# EAGLE design main (EAGLE 9.6.2)

## Sheet 1 of 2
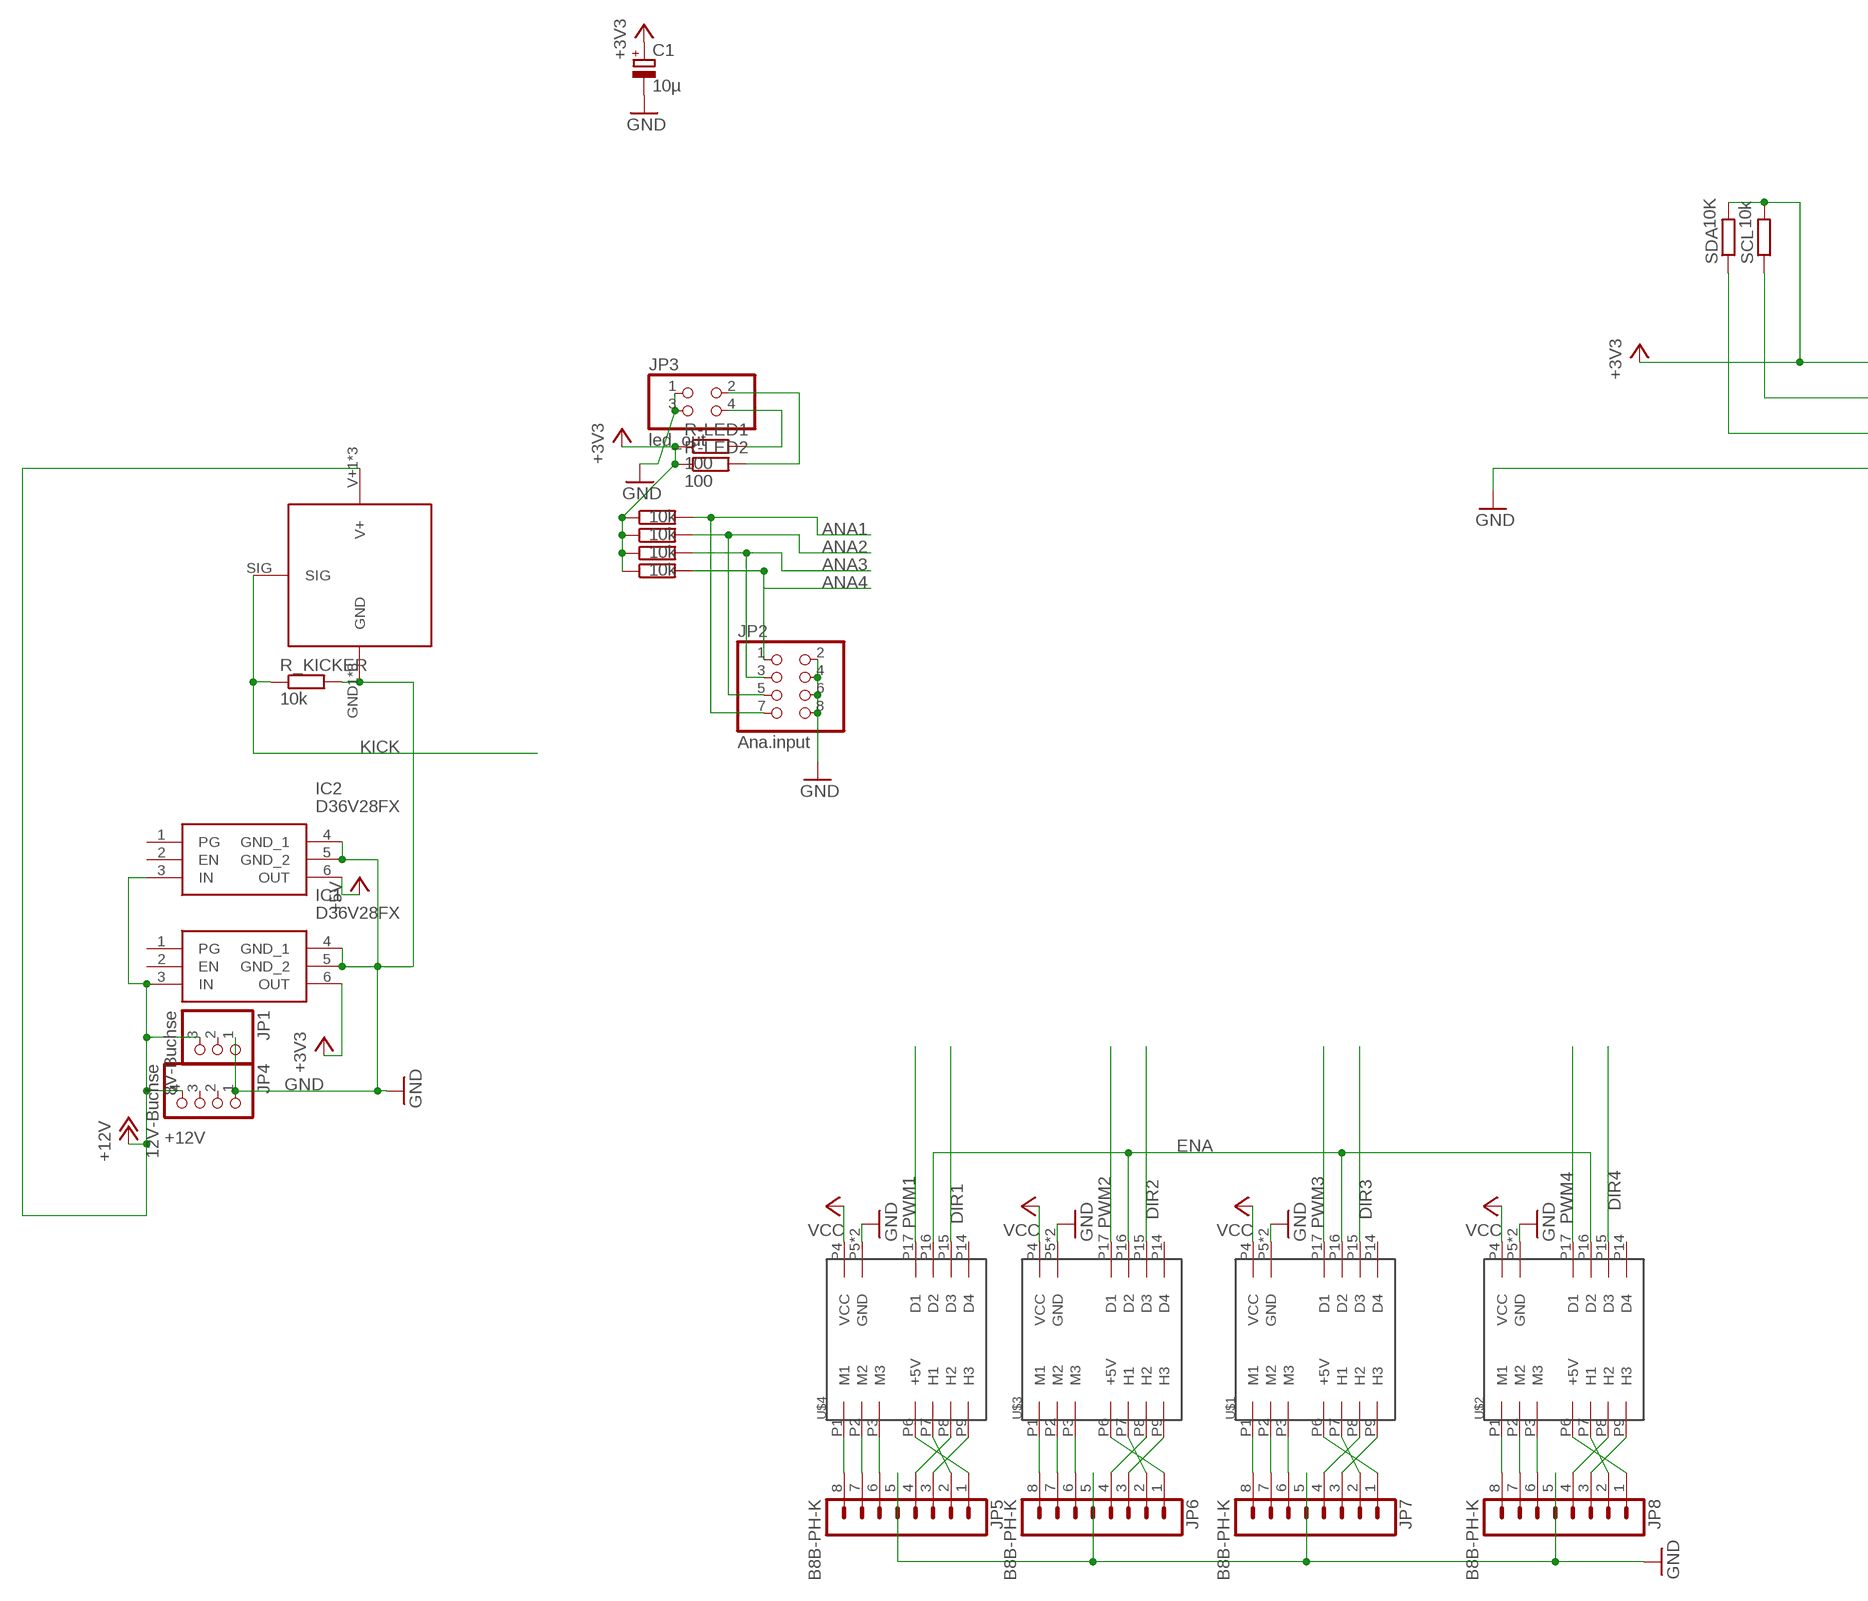
[diagram p0: schematic, sheet 1, part 1 of 2]
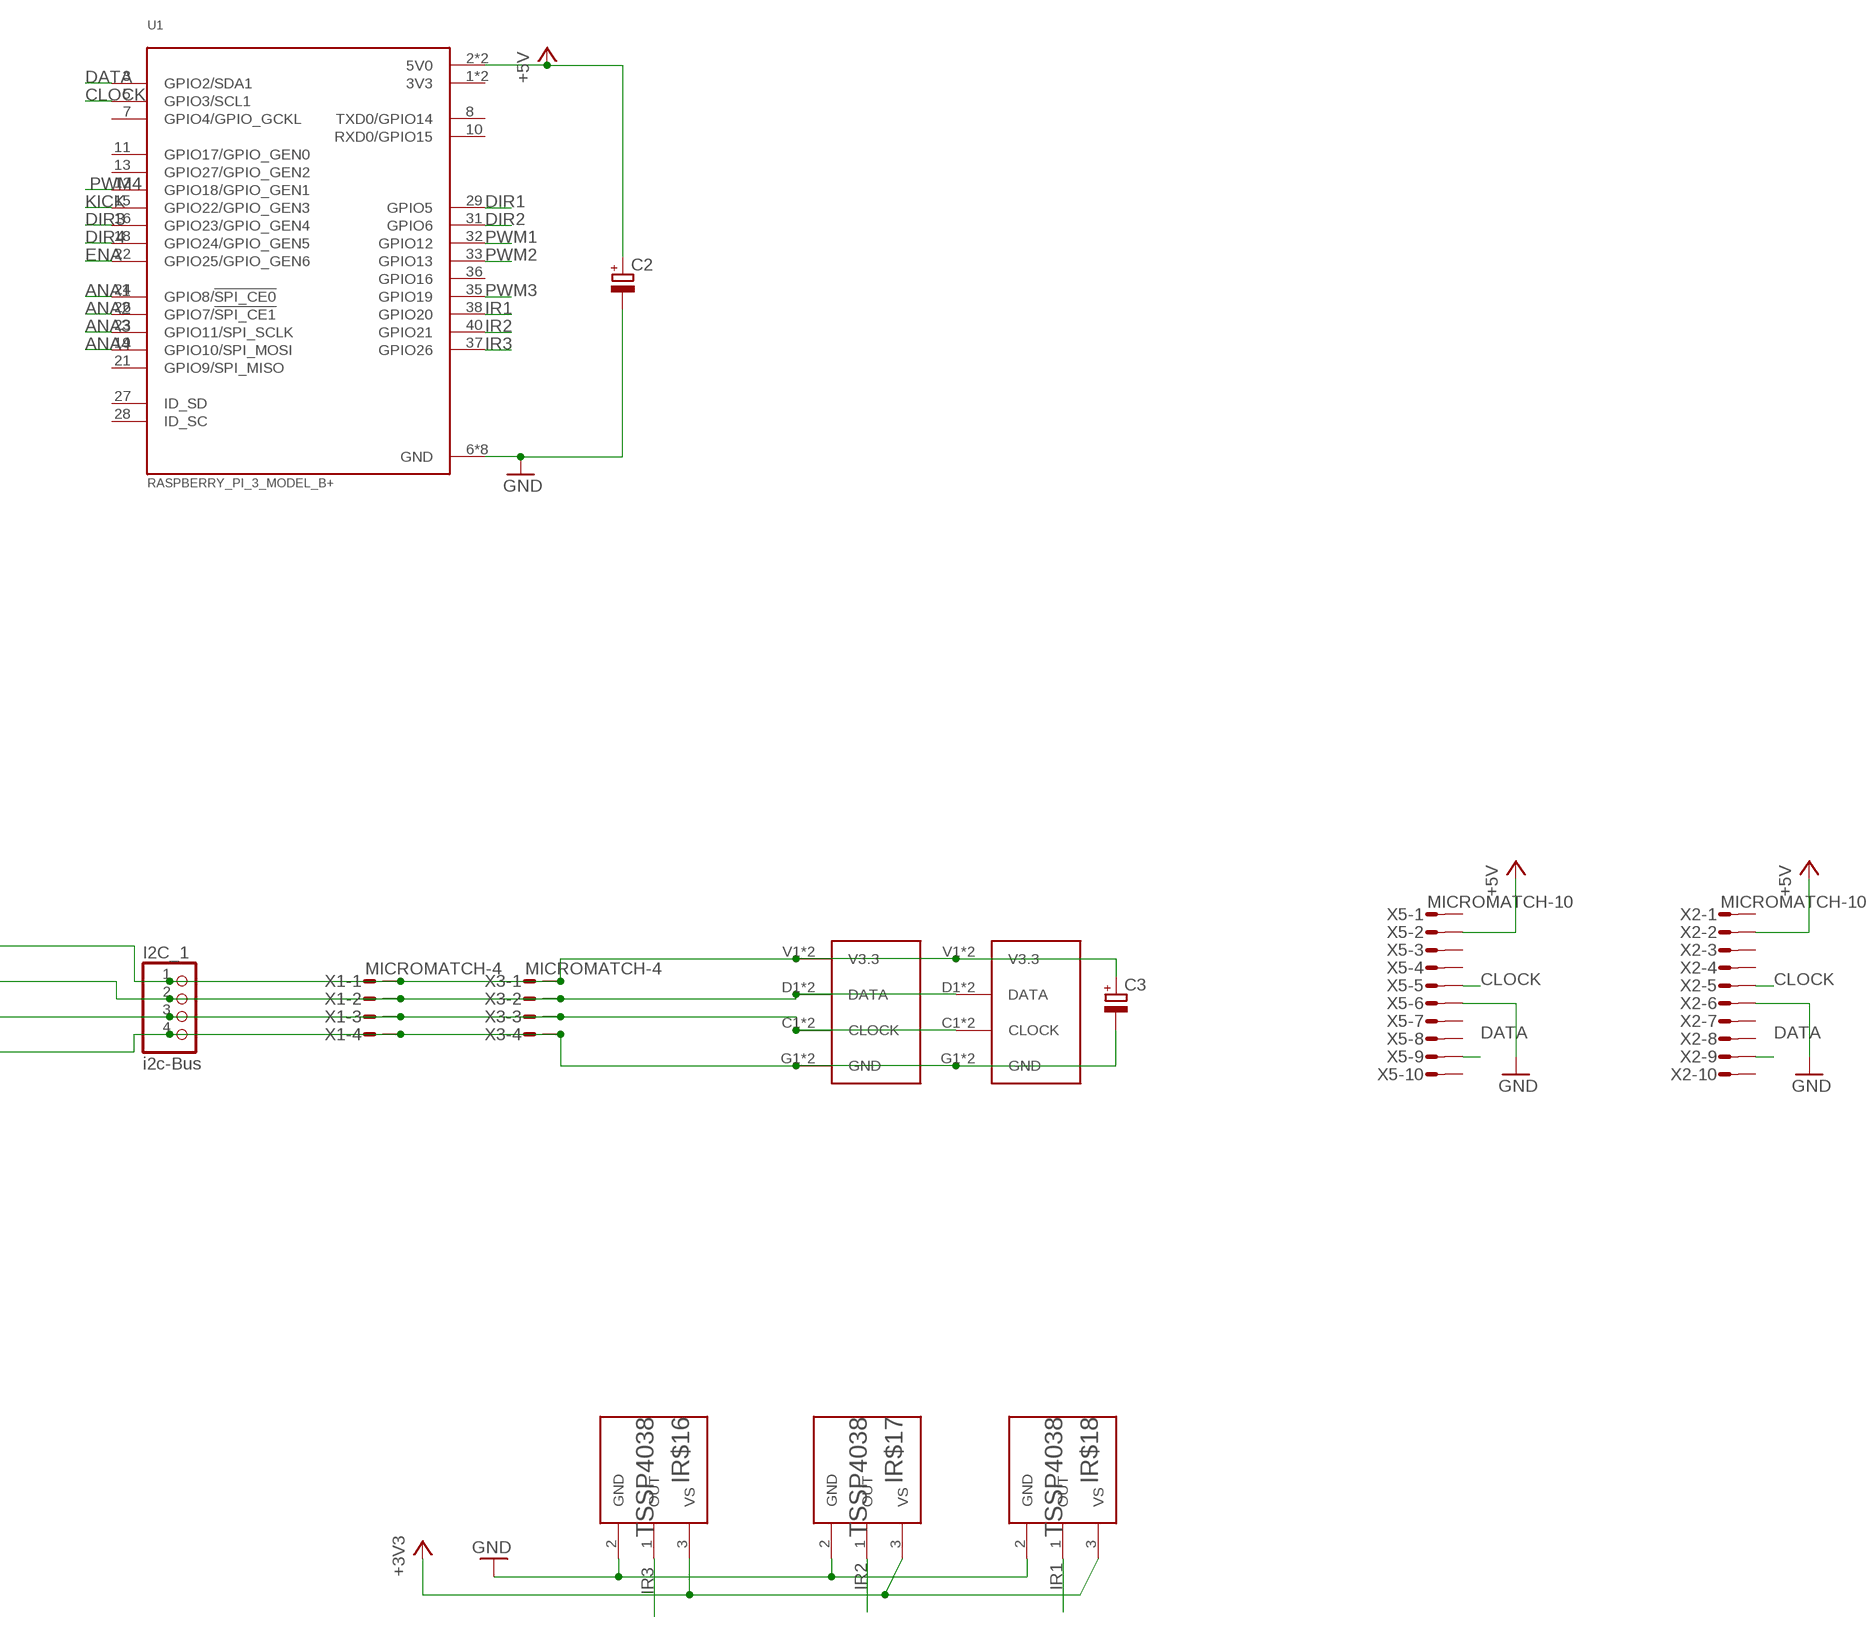
[diagram p1: schematic, sheet 1, part 2 of 2]

### Parts
C1  10µ  CPOL-EUE2,5-6E  [E2,5-6E]
C2  CPOL-EUE2-5  [E2-5]
C3  CPOL-EUE2-5  [E2-5]
I2C_1  i2c-Bus  PINHD-1X4  [1X04]
IC1  D36V28FX  [D36V28FX]
IC2  D36V28FX  [D36V28FX]
IR$16  TSSP4038  [XDCR_TSSP4038]
IR$17  TSSP4038  [XDCR_TSSP4038]
IR$18  TSSP4038  [XDCR_TSSP4038]
JP1  8V-Buchse  PINHD-1X3  [1X03]
JP2  Ana.input  PINHD-2X4  [2X04]
JP3  led_out  PINHD-2X2  [2X02]
JP4  12V-Buchse  PINHD-1X4  [1X04]
JP5  B8B-PH-K  [B8B-PH-K]
JP6  B8B-PH-K  [B8B-PH-K]
JP7  B8B-PH-K  [B8B-PH-K]
JP8  B8B-PH-K  [B8B-PH-K]
R-LED1  100  R-EU_0207/10  [0207/10]
R-LED2  100  R-EU_0207/10  [0207/10]
R_AD14  10k  R-EU_0207/10  [0207/10]
R_AD25  10k  R-EU_0207/10  [0207/10]
R_AD26  10k  R-EU_0207/10  [0207/10]
R_AD27  10k  R-EU_0207/10  [0207/10]
R_KICKER  10k  R-EU_0207/10  [0207/10]
SCL  10k  R-EU_0207/10  [0207/10]
SDA  10K  R-EU_0207/10  [0207/10]
U1  RASPBERRY_PI_3_MODEL_B+  [MODULE_RASPBERRY_PI_3_MODEL_B+]
U$1  24/2  [24/2]
U$2  24/2  [24/2]
U$3  24/2  [24/2]
U$4  24/2  [24/2]
U$8  TASTER_LED  [TASTER_LED]
U$9  TASTER_LED  [TASTER_LED]
U$17  KICKER  [KICKER]
X1  MICROMATCH-4  [MICROMATCH-4]
X2  MICROMATCH-10  [MICROMATCH-10]
X3  MICROMATCH-4  [MICROMATCH-4]
X5  MICROMATCH-10  [MICROMATCH-10]

### Nets
+3V3: C1.+ C3.+ I2C_1.1 IC1.6(OUT) IR$16.3(VS) IR$17.3(VS) IR$18.3(VS) R-LED1.1 R-LED2.1 R_AD14.1 R_AD25.1 R_AD26.1 R_AD27.1 SCL.2 SDA.2 U$8.V1(V3.3) U$8.V2(V3.3) U$9.V1(V3.3) U$9.V2(V3.3) X1.1 X3.1
+5V: C2.+ IC2.6(OUT) U1.2(5V0) U1.4(5V0) X2.2 X5.2
+12V: IC1.3(IN) IC2.3(IN) JP1.3 JP4.4 U$17.V+1(V+) U$17.V+2(V+) U$17.V+3(V+)
ANA1: JP2.7 R_AD25.2 U1.24(GPIO8/!SPI_CE0!)
ANA2: JP2.5 R_AD26.2 U1.26(GPIO7/!SPI_CE1!)
ANA3: JP2.3 R_AD27.2 U1.23(GPIO11/SPI_SCLK)
ANA4: JP2.1 R_AD14.2 U1.19(GPIO10/SPI_MOSI)
CLOCK: I2C_1.3 SDA.1 U1.5(GPIO3/SCL1) U$8.C1(CLOCK) U$8.C2(CLOCK) U$9.C1(CLOCK) U$9.C2(CLOCK) X1.3 X2.5 X3.3 X5.5
DATA: I2C_1.2 SCL.1 U1.3(GPIO2/SDA1) U$8.D1(DATA) U$8.D2(DATA) U$9.D1(DATA) U$9.D2(DATA) X1.2 X2.9 X3.2 X5.9
DIR1: U1.29(GPIO5) U$4.P15(D3)
DIR2: U1.31(GPIO6) U$3.P15(D3)
DIR3: U1.16(GPIO23/GPIO_GEN4) U$1.P15(D3)
DIR4: U1.18(GPIO24/GPIO_GEN5) U$2.P15(D3)
ENA: U1.22(GPIO25/GPIO_GEN6) U$1.P16(D2) U$2.P16(D2) U$3.P16(D2) U$4.P16(D2)
GND: C1.- C2.- C3.- I2C_1.4 IC1.4(GND_1) IC1.5(GND_2) IC2.4(GND_1) IC2.5(GND_2) IR$16.2(GND) IR$17.2(GND) IR$18.2(GND) JP1.1 JP2.2 JP2.4 JP2.6 JP2.8 JP3.1 JP3.3 JP4.1 JP5.5 JP6.5 JP7.5 JP8.5 R_KICKER.2 U1.6(GND) U1.9(GND) U1.14(GND) U1.20(GND) U1.25(GND) U1.30(GND) U1.34(GND) U1.39(GND) U$1.P5(GND) U$1.P18(GND) U$2.P5(GND) U$2.P18(GND) U$3.P5(GND) U$3.P18(GND) U$4.P5(GND) U$4.P18(GND) U$8.G1(GND) U$8.G2(GND) U$9.G1(GND) U$9.G2(GND) U$17.GND1(GND) U$17.GND2(GND) U$17.GND3(GND) U$17.GND4(GND) U$17.GND5(GND) U$17.GND6(GND) U$17.GND7(GND) U$17.GND8(GND) X1.4 X2.6 X3.4 X5.6
IR1: IR$18.1(OUT) U1.38(GPIO20)
IR2: IR$17.1(OUT) U1.40(GPIO21)
IR3: IR$16.1(OUT) U1.37(GPIO26)
KICK: R_KICKER.1 U1.15(GPIO22/GPIO_GEN3) U$17.SIG
N$6: JP5.8 U$4.P1(M1)
N$7: JP5.7 U$4.P2(M2)
N$8: JP3.4 R-LED1.2
N$9: JP3.2 R-LED2.2
N$10: JP5.6 U$4.P3(M3)
N$11: JP6.8 U$3.P1(M1)
N$12: JP6.7 U$3.P2(M2)
N$13: JP6.6 U$3.P3(M3)
N$14: JP7.8 U$1.P1(M1)
N$15: JP7.7 U$1.P2(M2)
N$16: JP7.6 U$1.P3(M3)
N$17: JP8.8 U$2.P1(M1)
N$18: JP8.7 U$2.P2(M2)
N$19: JP8.6 U$2.P3(M3)
N$20: JP5.1 U$4.P6(+5V)
N$21: JP6.1 U$3.P6(+5V)
N$22: JP7.1 U$1.P6(+5V)
N$23: JP8.1 U$2.P6(+5V)
N$24: JP5.2 U$4.P7(H1)
N$25: JP5.3 U$4.P9(H3)
N$26: JP5.4 U$4.P8(H2)
N$27: JP6.2 U$3.P7(H1)
N$28: JP6.3 U$3.P9(H3)
N$29: JP6.4 U$3.P8(H2)
N$30: JP7.2 U$1.P7(H1)
N$31: JP7.3 U$1.P9(H3)
N$32: JP7.4 U$1.P8(H2)
N$33: JP8.2 U$2.P7(H1)
N$34: JP8.3 U$2.P9(H3)
N$35: JP8.4 U$2.P8(H2)
PWM1: U1.32(GPIO12) U$4.P17(D1)
PWM2: U1.33(GPIO13) U$3.P17(D1)
PWM3: U1.35(GPIO19) U$1.P17(D1)
PWM4: U1.12(GPIO18/GPIO_GEN1) U$2.P17(D1)
V+: U$1.P4(VCC) U$2.P4(VCC) U$3.P4(VCC) U$4.P4(VCC) ; supply symbol labelled VCC
Unconnected: IC1.1(PG) IC1.2(EN) IC2.1(PG) IC2.2(EN) JP1.2 JP4.2 JP4.3 U1.7(GPIO4/GPIO_GCKL) U1.8(TXD0/GPIO14) U1.10(RXD0/GPIO15) U1.11(GPIO17/GPIO_GEN0) U1.13(GPIO27/GPIO_GEN2) U1.21(GPIO9/SPI_MISO) U1.27(ID_SD) U1.28(ID_SC) U1.36(GPIO16) U$1.P14(D4) U$2.P14(D4) U$3.P14(D4) U$4.P14(D4) X2.1 X2.3 X2.4 X2.7 X2.8 X2.10 X5.1 X5.3 X5.4 X5.7 X5.8 X5.10

## Sheet 2 of 2

## Power pins joined to a net without a drawn wire
3V3: U1.1(3V3) U1.17(3V3)

## Library data of the parts
C1-C3 = rcl:CPOL-EU: POLARIZED CAPACITOR, European symbol; SPICEPREFIX: C
I2C_1 JP4 = pinhead:PINHD-1X4: PIN HEADER
IC1 IC2 = D36V28FX:D36V28FX: 5V, 3.2A Step-Down Voltage Regulator D36V28F5 Source: Datasheet <https://www.pololu.com/product/3782>; DESCRIPTION: 5V, 3.2A Step-Down Voltage Regulator D36V28F5; HEIGHT: 8.77mm; MANUFACTURER_NAME: POLOLU ROBOTICS & ELECTRONICS; MANUFACTURER_PART_NUMBER: D36V28FX
IR$16-IR$18 = TSSP4038:TSSP4038: Check availability <https://pricing.snapeda.com/parts/TSSP4038/Vishay%20Semiconductor/view-part?ref=eda>; AVAILABILITY: In Stock; DESCRIPTION: Remote Receiver Sensor, 38.0kHz 1m PCB, Through Hole; MF: Vishay Semiconductor; MP: TSSP4038; PACKAGE: None; PRICE: None; PURCHASE-URL: https://pricing.snapeda.com/search/part/TSSP4038/?ref=eda
JP1 = pinhead:PINHD-1X3: PIN HEADER
JP2 = pinhead:PINHD-2X4: PIN HEADER
JP3 = pinhead:PINHD-2X2: PIN HEADER
JP5-JP8 = con-jst-ph:B8B-PH-K: HEADER
R-LED1 R-LED2 R_AD14 R_AD25-R_AD27 R_KICKER SCL SDA = rcl:R-EU_: RESISTOR, European symbol; SPICEPREFIX: R
U1 = RASPBERRY_PI_3_MODEL_B_:RASPBERRY_PI_3_MODEL_B+: BCM2835 Raspberry Pi Model B+ - ARM11, VideoCore MPU Embedded Evaluation Board Check availability <https://pricing.snapeda.com/parts/RASPBERRY%20PI%203%20MODEL%20B%2B/Raspberry%20Pi/view-part?ref=eda>; AVAILABILITY: In Stock; DESCRIPTION: RASPBERRY PI 3 MOD B+ BCM2837B0; MF: Raspberry Pi; MP: RASPBERRY PI 3 MODEL B+; PACKAGE: None; PRICE: None; PURCHASE-URL: https://pricing.snapeda.com/search/part/RASPBERRY PI 3 MODEL B+/?ref=eda
U$1-U$4 = maxon-Regler:24/2
U$8 U$9 = Taster_LED:TASTER_LED: Taster / LED Board mit 2 Tastern und 2 LEDs Angeschlossen über i2c Port Expander PCF8574TS i2c Adresse zwingend per Lötbrücke zu setzen.
U$17 = kicker:KICKER
X1 X3 = con-amp-micromatch:MICROMATCH-4: MicroMaTch 4 7-215464-4 / 0-215464-4 Drawing Number C-215464 DDEController.pdf; MPN: 7-215464-4; OC_FARNELL: 3784629; OC_NEWARK: 19R8124
X2 X5 = con-amp-micromatch:MICROMATCH-10: MicroMaTch 10 8-215464-0 / 1-215464-0 Drawing Number C-215464 DDEController.pdf; MF: FARNELL; MPN: 8-215464-0; OC_FARNELL: 3784654; OC_NEWARK: 19J6430

## Board
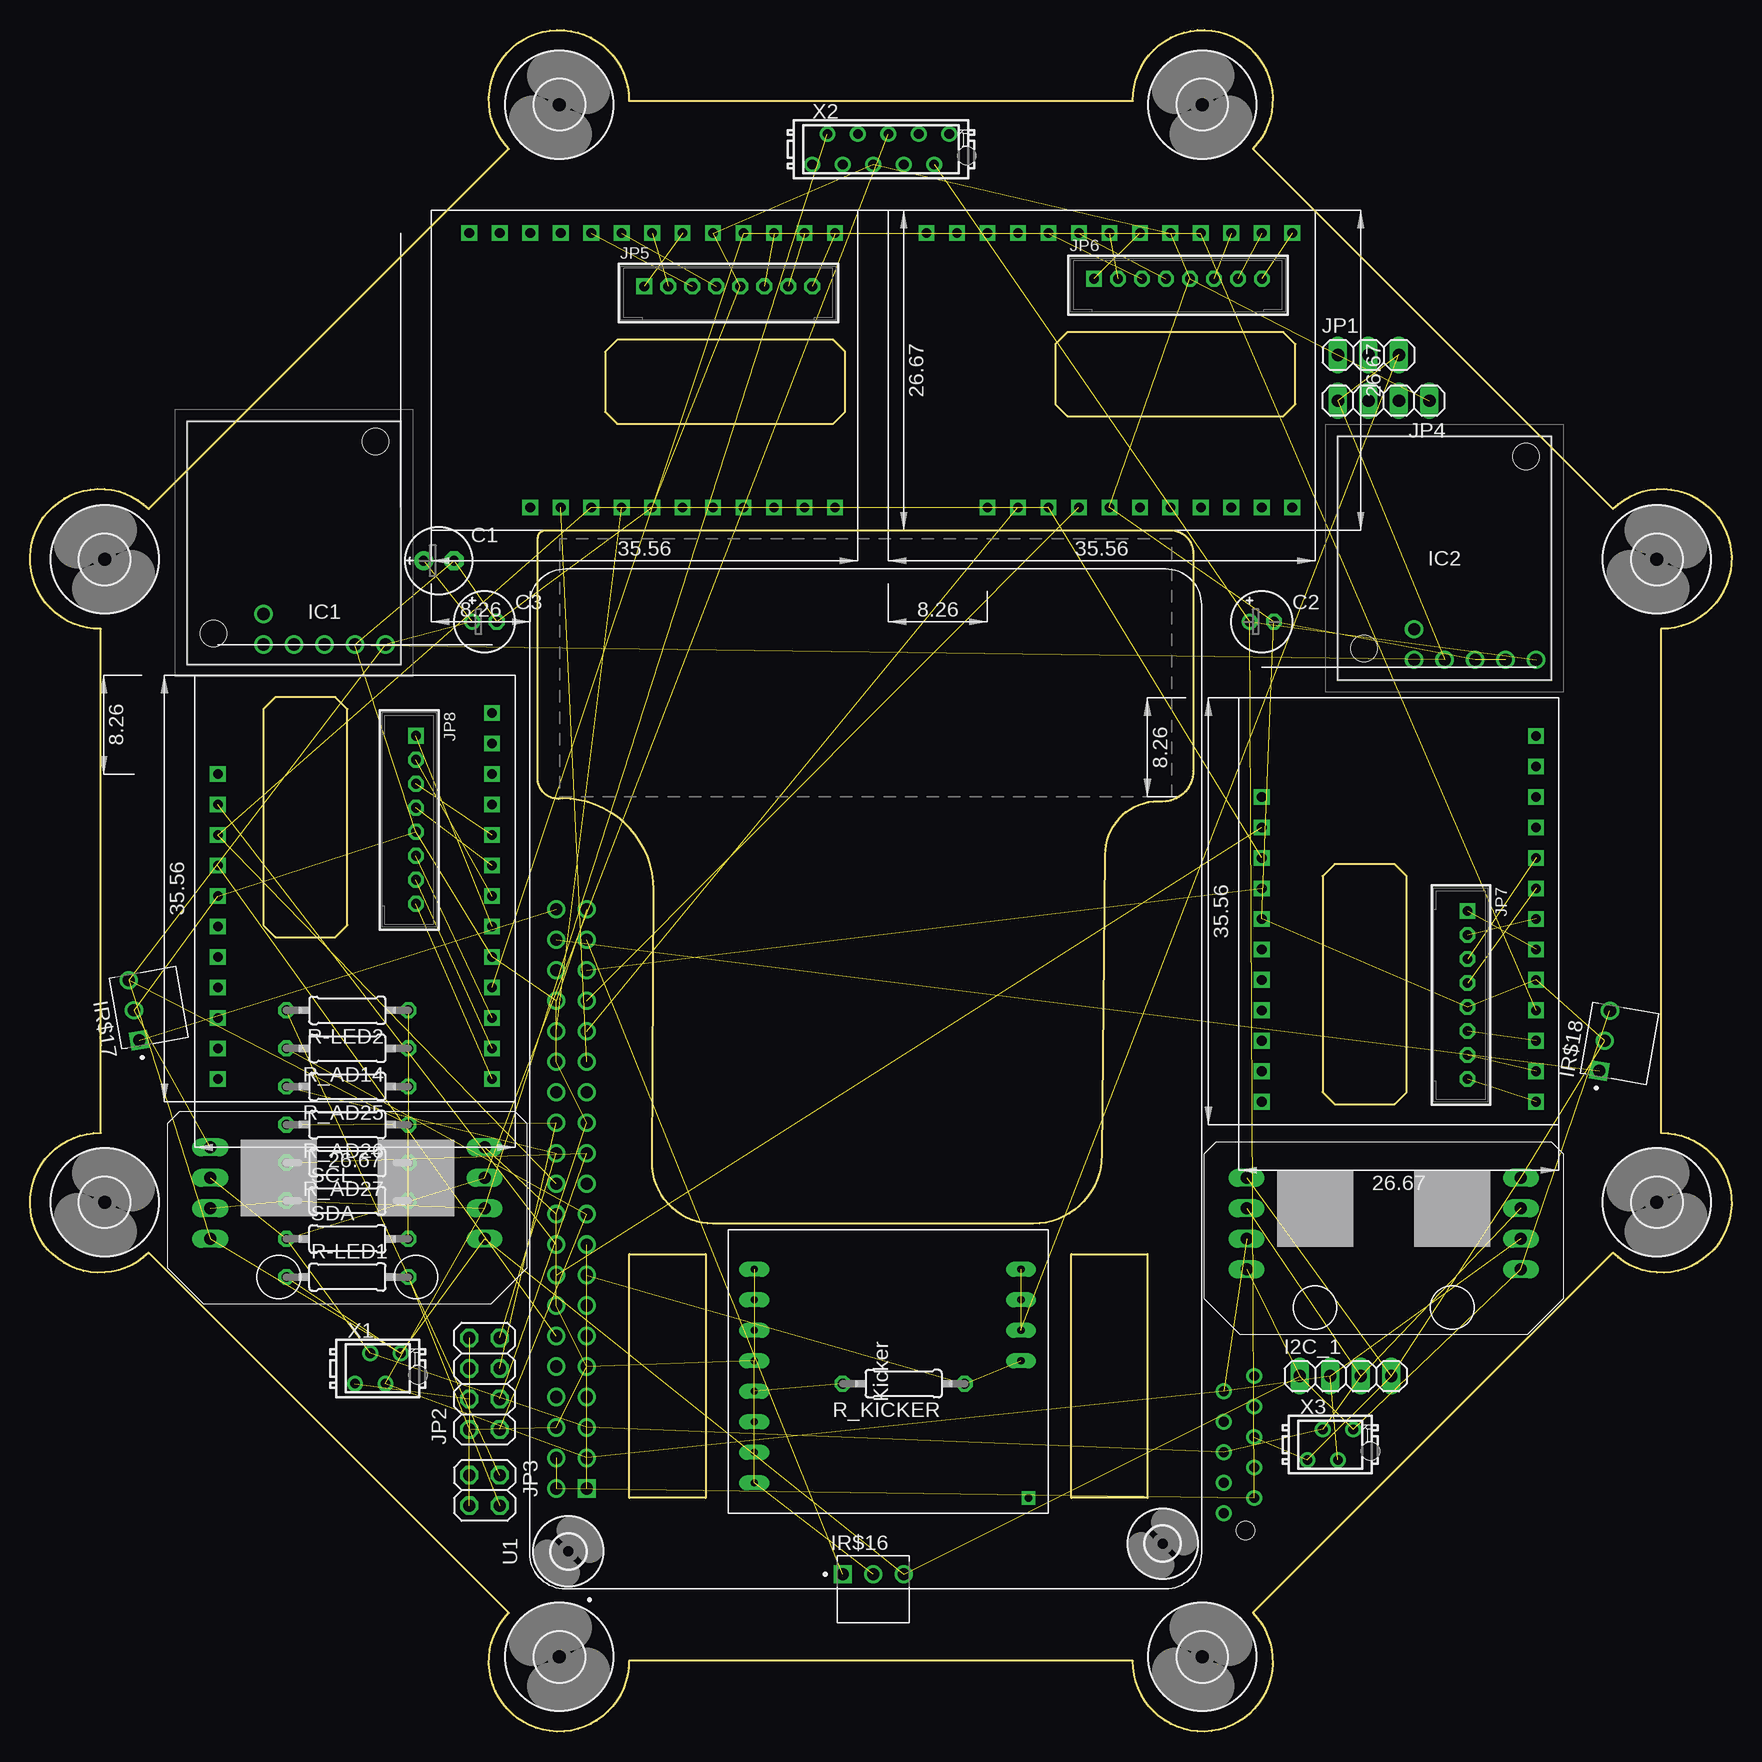
[diagram p2: board, top side]
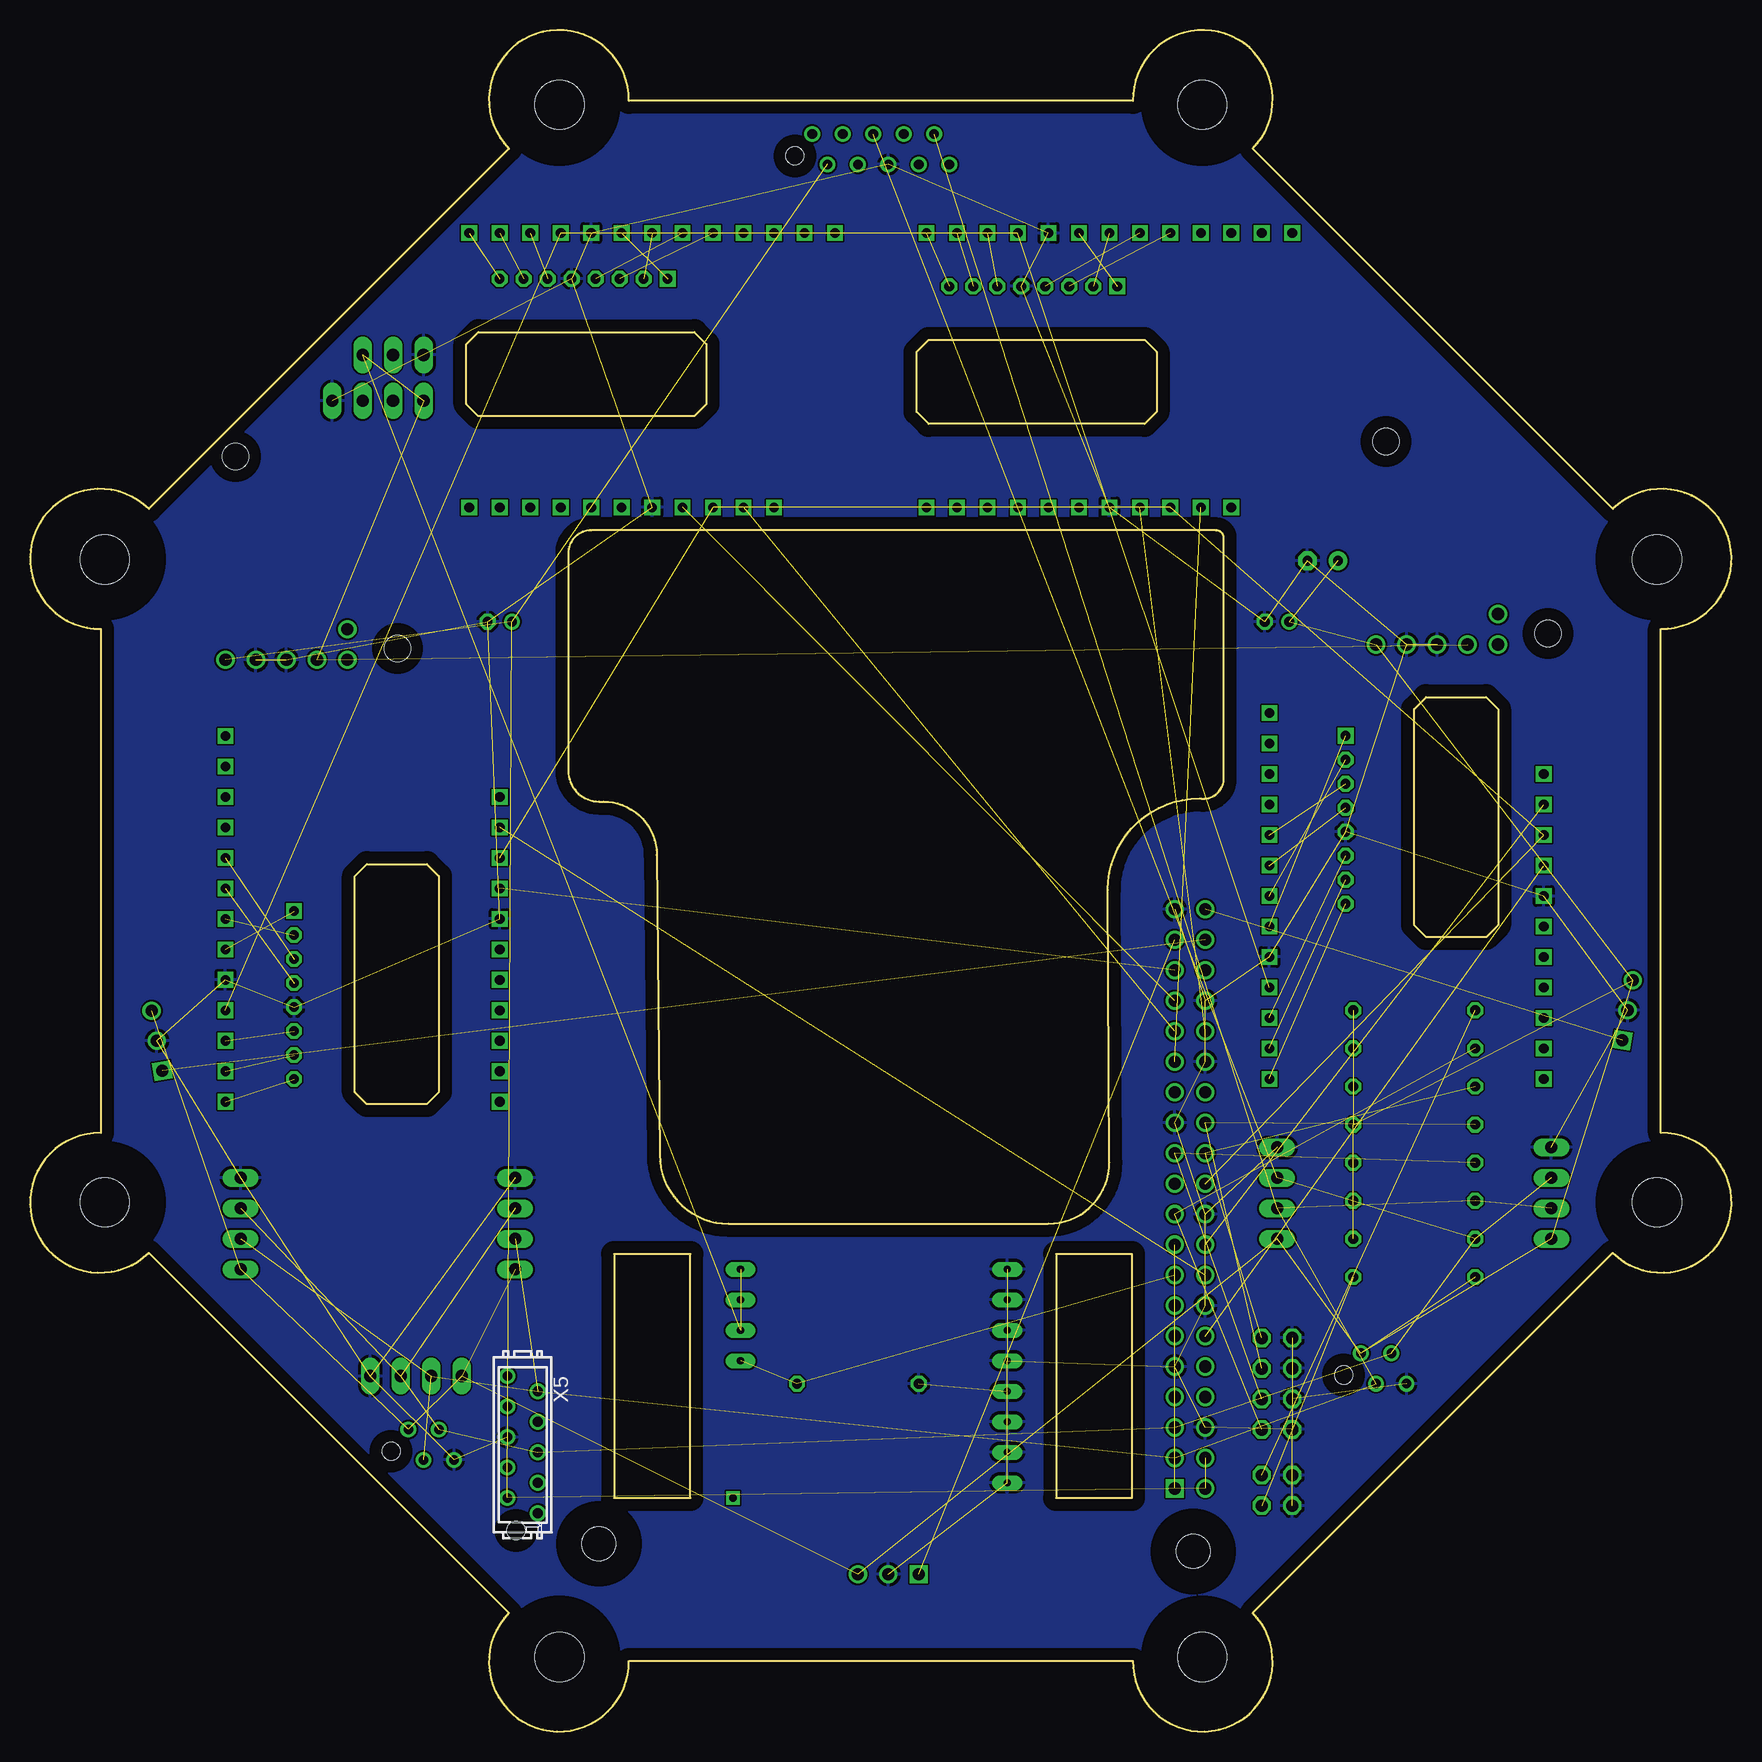
[diagram p3: board, bottom side, seen from below]

Size 141.8 x 141.8 mm. Coordinates in mm from the lower left corner, seen from the top.
Outline: 5.9,49.9 5.9,91.9 arc-225 9.9,101.9 39.9,131.9 arc-225 49.9,135.9 91.9,135.9 arc-225 101.9,131.9 131.9,101.9 arc-225 135.9,91.9 135.9,49.9 arc-225 131.9,39.9 101.9,9.9 arc-225 91.9,5.9 49.9,5.9 arc-225 39.9,9.9 9.9,39.9 arc-225 5.9,49.9
Outline: 114.71,53.29 114.71,71.29 113.71,72.29 108.71,72.29 107.71,71.29 107.71,53.29 108.71,52.29 113.71,52.29 114.71,53.29
Outline: 86.44,109.62 104.44,109.62 105.44,110.62 105.44,115.62 104.44,116.62 86.44,116.62 85.44,115.62 85.44,110.62 86.44,109.62
Outline: 26.45,67.2 26.45,85.2 25.45,86.2 20.45,86.2 19.45,85.2 19.45,67.2 20.45,66.2 25.45,66.2 26.45,67.2
Outline: 48.92,108.98 66.92,108.98 67.92,109.98 67.92,114.98 66.92,115.98 48.92,115.98 47.92,114.98 47.92,109.98 48.92,108.98
Outline: 42.96,100.11 95.03,100.11 arc-90 96.93,98.2 96.93,80.04 arc-90 94.39,77.5 94.01,77.5 arc90 89.57,73.06 89.31,48.04 arc-90 83.6,42.32 56.93,42.32 arc-90 51.85,47.4 51.97,70.14 arc90 44.35,77.76 arc-90 42.32,79.15 42.32,99.47 arc-90 42.96,100.11
Outline: 49.94,39.78 56.29,39.78 56.29,19.46 49.94,19.46 49.94,39.78
Outline: 86.77,39.78 93.12,39.78 93.12,19.46 86.77,19.46 86.77,39.78
Copper layers (1*16): Top 0.035mm / dielectric 1.5mm / Bottom 0.035mm
Design rules "default": minimum track width 6mil, minimum drill 0.35mm, track to track 6mil, track to pad 6mil, pad to pad 6mil, via to via 6mil, smd to smd 6mil, copper to edge 40mil, drill to drill 6mil, minimum pad ring 10mil, minimum via ring 8mil, stop-mask expansion 4mil, vias tented up to drill 0mil, thermal gap 10mil

### Footprints (pad centres in the part's own frame; a part is rotated, then mirrored left to right if it is on the bottom)
E2,5-6E = drill 0.813 pad 1.575: + -1.27,0 | drill 0.813 pad 1.575 octagon: - 1.27,0
E2-5 = drill 0.813 pad 1.27: + -1.016,0 | drill 0.813 pad 1.27 octagon: - 1.016,0
1X04 = drill 1.016 long: 1 -3.81,0; 2 -1.27,0; 3 1.27,0; 4 3.81,0
D36V28FX = drill 1.02 pad 1.53: 1 0,0; 2 0,-2.54; 3 2.54,-2.54; 4 5.08,-2.54; 5 7.62,-2.54; 6 10.16,-2.54 | hole 2.18: -4.17,-1.61; 9.33,14.39
XDCR_TSSP4038 = drill 1.01 square: 1 -2.54,0 | drill 1.01: 2 0,0; 3 2.54,0
1X03 = drill 1.016 long: 1 -2.54,0; 2 0,0; 3 2.54,0
2X04 = drill 1.016 octagon: 1 -3.81,-1.27; 2 -3.81,1.27; 3 -1.27,-1.27; 4 -1.27,1.27; 5 1.27,-1.27; 6 1.27,1.27; 7 3.81,-1.27; 8 3.81,1.27
2X02 = drill 1.016 octagon: 1 -1.27,-1.27; 2 -1.27,1.27; 3 1.27,-1.27; 4 1.27,1.27
B8B-PH-K = drill 0.813 square: 1 -7,0 | drill 0.813 octagon: 2 -5,0; 3 -3,0; 4 -1,0; 5 1,0; 6 3,0; 7 5,0; 8 7,0
0207/10 = drill 0.813 octagon: 1 -5.08,0; 2 5.08,0
MODULE_RASPBERRY_PI_3_MODEL_B+ = drill 1.016 square: 1 -34.13,23.23 | drill 1.016: 2 -34.13,25.77; 3 -31.59,23.23; 4 -31.59,25.77; 5 -29.05,23.23; 6 -29.05,25.77; 7 -26.51,23.23; 8 -26.51,25.77; 9 -23.97,23.23; 10 -23.97,25.77; 11 -21.43,23.23; 12 -21.43,25.77; 13 -18.89,23.23; 14 -18.89,25.77; 15 -16.35,23.23; 16 -16.35,25.77; 17 -13.81,23.23; 18 -13.81,25.77; 19 -11.27,23.23; 20 -11.27,25.77; 21 -8.73,23.23; 22 -8.73,25.77; 23 -6.19,23.23; 24 -6.19,25.77; 25 -3.65,23.23; 26 -3.65,25.77; 27 -1.11,23.23; 28 -1.11,25.77; 29 1.43,23.23; 30 1.43,25.77; 31 3.97,23.23; 32 3.97,25.77; 33 6.51,23.23; 34 6.51,25.77; 35 9.05,23.23; 36 9.05,25.77; 37 11.59,23.23; 38 11.59,25.77; 39 14.13,23.23; 40 14.13,25.77
24/2 = drill 0.8 square: P1 15.875,10.795; P2 13.335,10.795; P3 10.795,10.795; P4 8.255,10.795; P5 5.715,10.795; P6 3.175,10.795; P7 0.635,10.795; P8 -1.905,10.795; P9 -4.445,10.795; P10 -6.985,10.795; P11 -9.525,10.795; P12 -12.065,10.795; P13 -14.605,10.795; P14 -9.525,-12.065; P15 -6.985,-12.065; P16 -4.445,-12.065; P17 -1.905,-12.065; P18 0.635,-12.065; P19 3.175,-12.065; P20 5.715,-12.065; P21 8.255,-12.065; P22 10.795,-12.065; P23 13.335,-12.065; P24 15.875,-12.065
4,1 = hole 4.1: 0,0
TASTER_LED = drill 1 long: C1 -11.43,-4.445; C2 11.43,-4.445; D1 -11.43,-1.905; D2 11.43,-1.905; G1 -11.43,-6.985; G2 11.43,-6.985; V1 -11.43,0.635; V2 11.43,0.635
2,8 = hole 2.8: 0,0
KICKER = drill 0.6 pad 1.27 long: GND1 2.54,24.511; GND2 5.08,24.511; GND3 7.62,24.511; GND4 10.16,24.511; GND5 12.7,24.511; GND6 15.24,24.511; GND7 17.78,24.511; GND8 20.32,24.511; SIG 12.7,2.286; V+1 15.24,2.286; V+2 17.78,2.286; V+3 20.32,2.286 | drill 0.6 square: NC 1.27,1.651
MICROMATCH-4 = drill 0.8: 1 1.905,1.27; 2 0.635,-1.27; 3 -0.635,1.27; 4 -1.905,-1.27 | hole 1.5: 3.34,-0.55
MICROMATCH-10 = drill 0.813: 1 5.715,1.27; 2 4.445,-1.27; 3 3.175,1.27; 4 1.905,-1.27; 5 0.635,1.27; 6 -0.635,-1.27; 7 -1.905,1.27; 8 -3.175,-1.27; 9 -4.445,1.27; 10 -5.715,-1.27 | hole 1.5: 7.16,-0.55

### Placement (x,y rotation side)
C1  34.07,97.57 0 top
C2  102.65,92.49 0 top
C3  37.88,92.49 0 top
I2C_1  109.63,29.62 0 top
IC1  19.46,93.12 0 top
IC2  115.35,91.85 0 top
IR$16  70.26,13.11 0 top
IR$17  8.67,60.1 100 top
IR$18  131.22,57.56 80 top
JP1  111.54,114.71 0 top
JP2  37.88,28.99 90 top
JP3  37.88,20.1 270 top
JP4  112.81,110.9 180 top
JP5  58.2,120.43 0 top
JP6  95.66,121.06 0 top
JP7  119.79,61.37 270 top
JP8  32.16,75.98 270 top
R-LED1  26.45,37.88 0 top
R-LED2  26.45,60.1 180 top
R_AD14  26.45,56.93 180 top
R_AD25  26.45,53.75 180 top
R_AD26  26.45,50.58 180 top
R_AD27  26.45,47.4 180 top
R_KICKER  72.8,28.99 180 top
SCL  26.45,44.23 0 top
SDA  26.45,41.05 0 top
U1  69.63,54.39 90 top
U$1  114.71,68.36 270 top
U$2  27.72,70.26 270 top
U$3  89.31,114.08 0 top
U$4  51.21,114.08 0 top
U$5  [4,1]  6.23,97.69 67.5 top
U$6  [4,1]  97.69,135.57 67.5 top
U$7  [4,1]  135.57,44.11 67.5 top
U$8  26.45,41.69 180 top
U$9  112.81,39.15 180 top
U$10  [4,1]  44.11,6.23 67.5 top
U$11  [4,1]  44.11,135.57 22.5 top
U$12  [4,1]  135.57,97.69 22.5 top
U$13  [4,1]  97.69,6.23 22.5 top
U$14  [4,1]  6.23,44.11 22.5 top
U$15  [2,8]  94.39,15.65 0 top
U$16  [2,8]  44.86,15.02 0 top
U$17  84.87,18.19 90 top
X1  28.99,30.26 0 top
X2  70.9,131.86 0 top
X3  108.36,23.91 0 top
X5  100.74,23.91 270 bottom

### Tracks (layer width: path | path; a pad name or v marks a point on that pad's centre or on a via)
3V3  (1 unrouted)
+3V3  (20 unrouted)
+5V  (5 unrouted)
+12V  (6 unrouted)
ANA1  (2 unrouted)
ANA2  (2 unrouted)
ANA3  (2 unrouted)
ANA4  (2 unrouted)
CLOCK  (10 unrouted)
DATA  (10 unrouted)
DIR1  (1 unrouted)
DIR2  (1 unrouted)
DIR3  (1 unrouted)
DIR4  (1 unrouted)
ENA  (4 unrouted)
GND  (55 unrouted)
  pour Bottom: 44.23,135.67 97.57,135.67 135.67,97.57 135.67,44.23 97.57,6.13 44.23,6.13 6.13,44.23 6.13,97.57
IR1  (1 unrouted)
IR2  (1 unrouted)
IR3  (1 unrouted)
KICK  (2 unrouted)
N$6  (1 unrouted)
N$7  (1 unrouted)
N$8  (1 unrouted)
N$9  (1 unrouted)
N$10  (1 unrouted)
N$11  (1 unrouted)
N$12  (1 unrouted)
N$13  (1 unrouted)
N$14  (1 unrouted)
N$15  (1 unrouted)
N$16  (1 unrouted)
N$17  (1 unrouted)
N$18  (1 unrouted)
N$19  (1 unrouted)
N$20  (1 unrouted)
N$21  (1 unrouted)
N$22  (1 unrouted)
N$23  (1 unrouted)
N$24  (1 unrouted)
N$25  (1 unrouted)
N$26  (1 unrouted)
N$27  (1 unrouted)
N$28  (1 unrouted)
N$29  (1 unrouted)
N$30  (1 unrouted)
N$31  (1 unrouted)
N$32  (1 unrouted)
N$33  (1 unrouted)
N$34  (1 unrouted)
N$35  (1 unrouted)
PWM1  (1 unrouted)
PWM2  (1 unrouted)
PWM3  (1 unrouted)
PWM4  (1 unrouted)
V+  (3 unrouted)